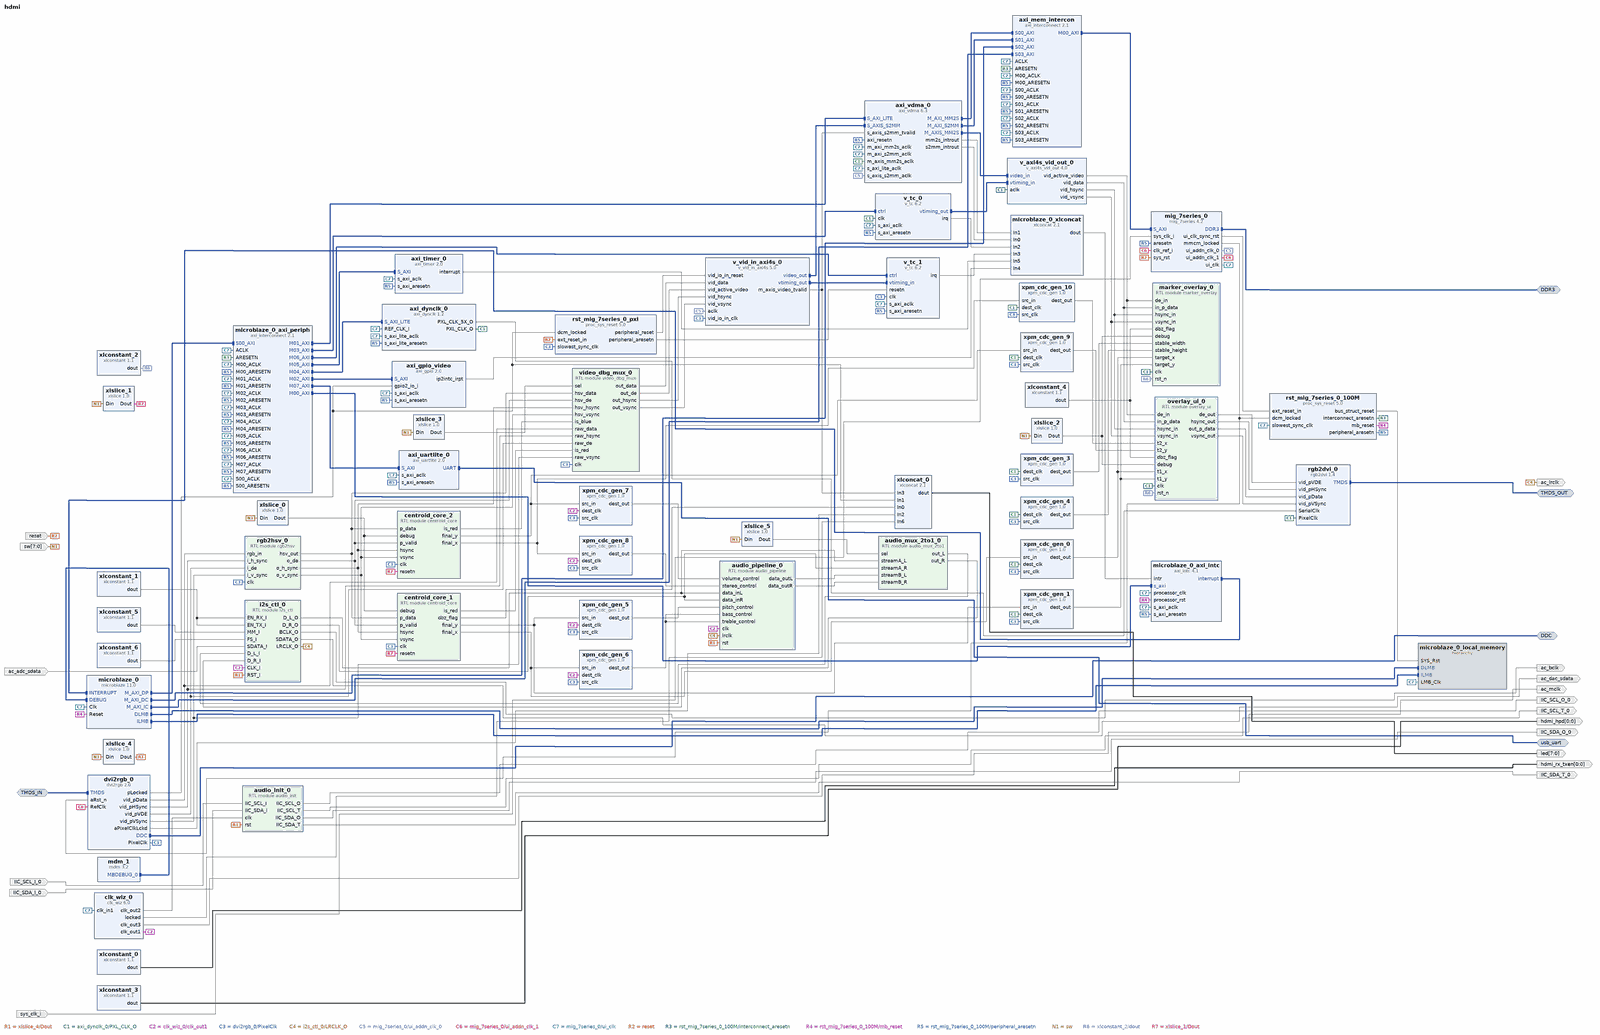
[diagram p0: block diagram of the top level, whole]
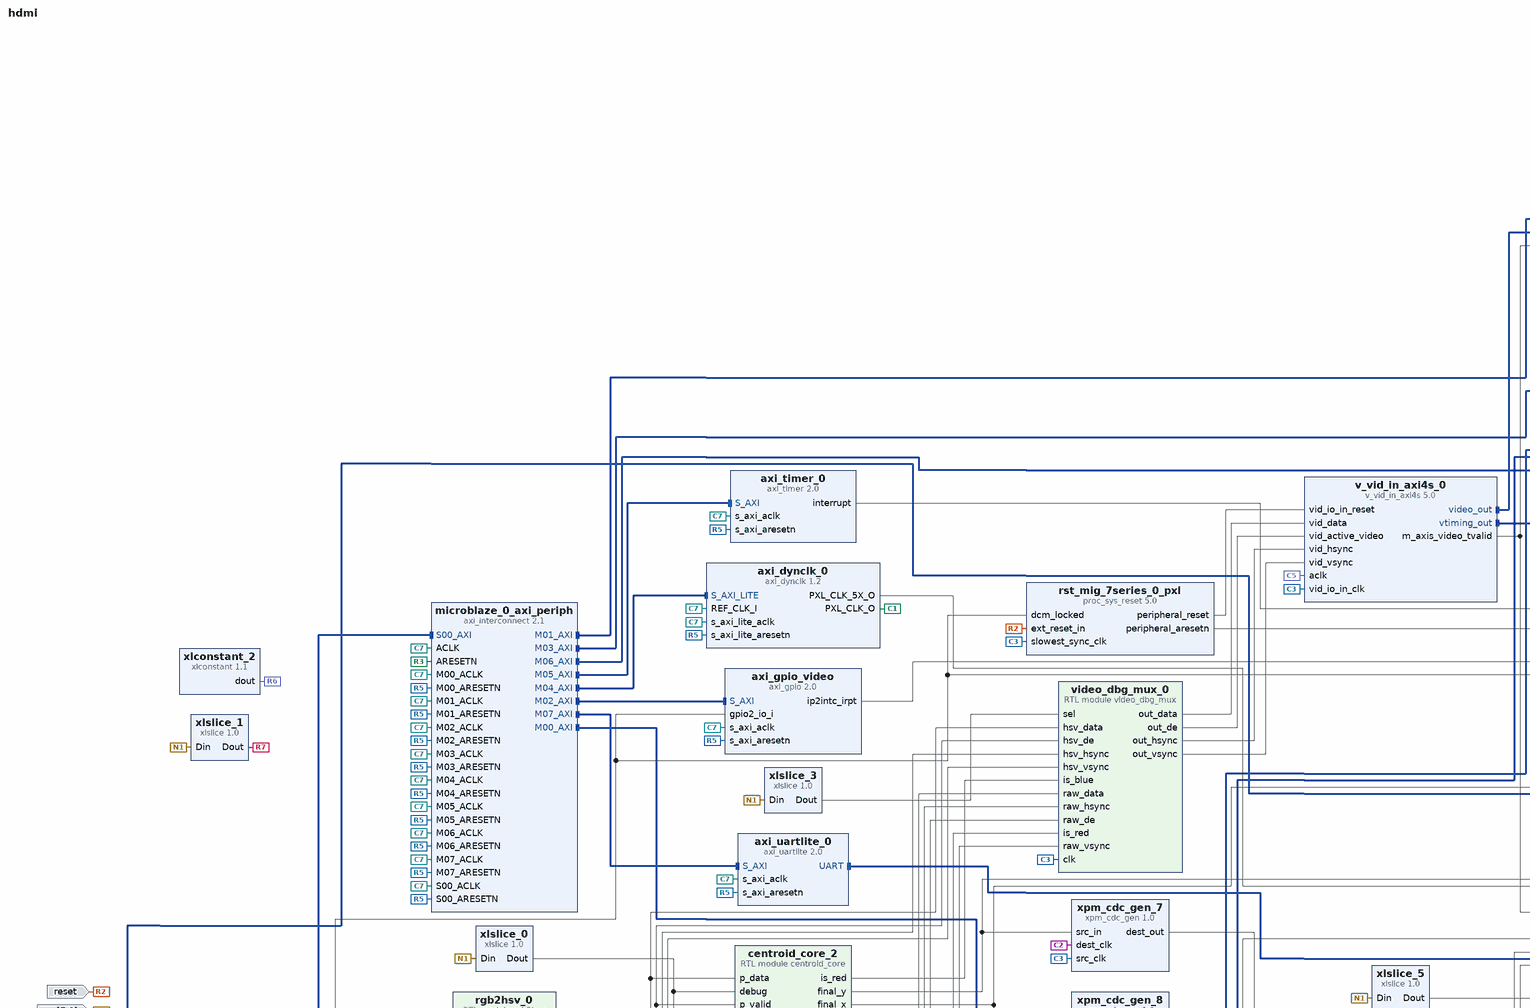
[diagram p1: block diagram of the top level, upper left part]
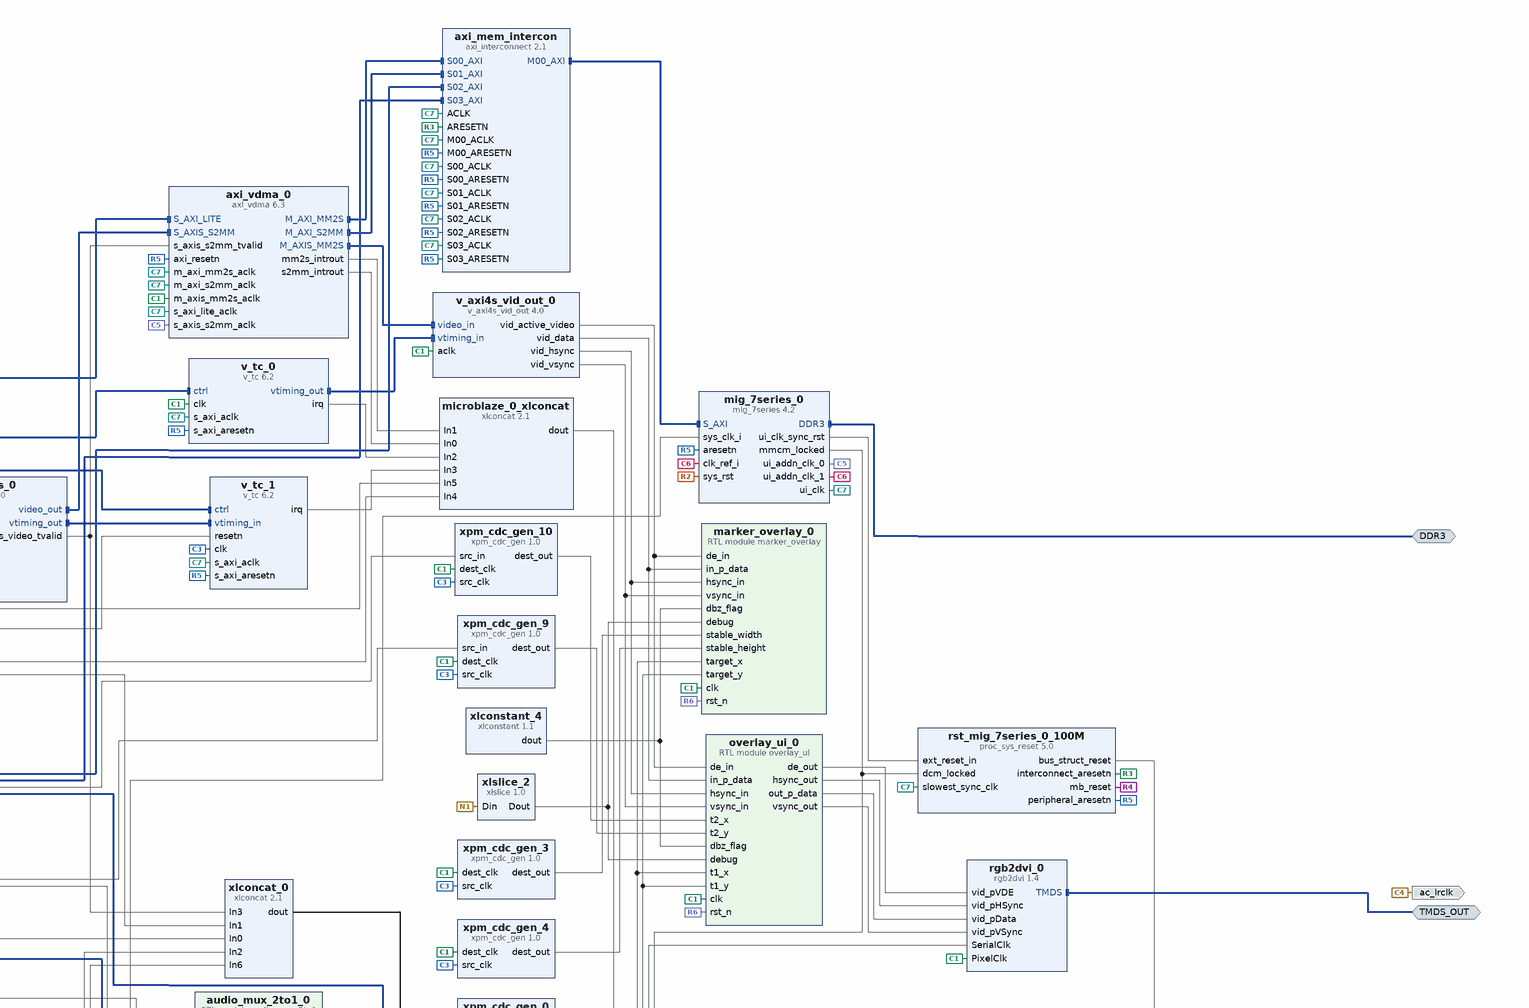
[diagram p2: block diagram of the top level, upper right part]
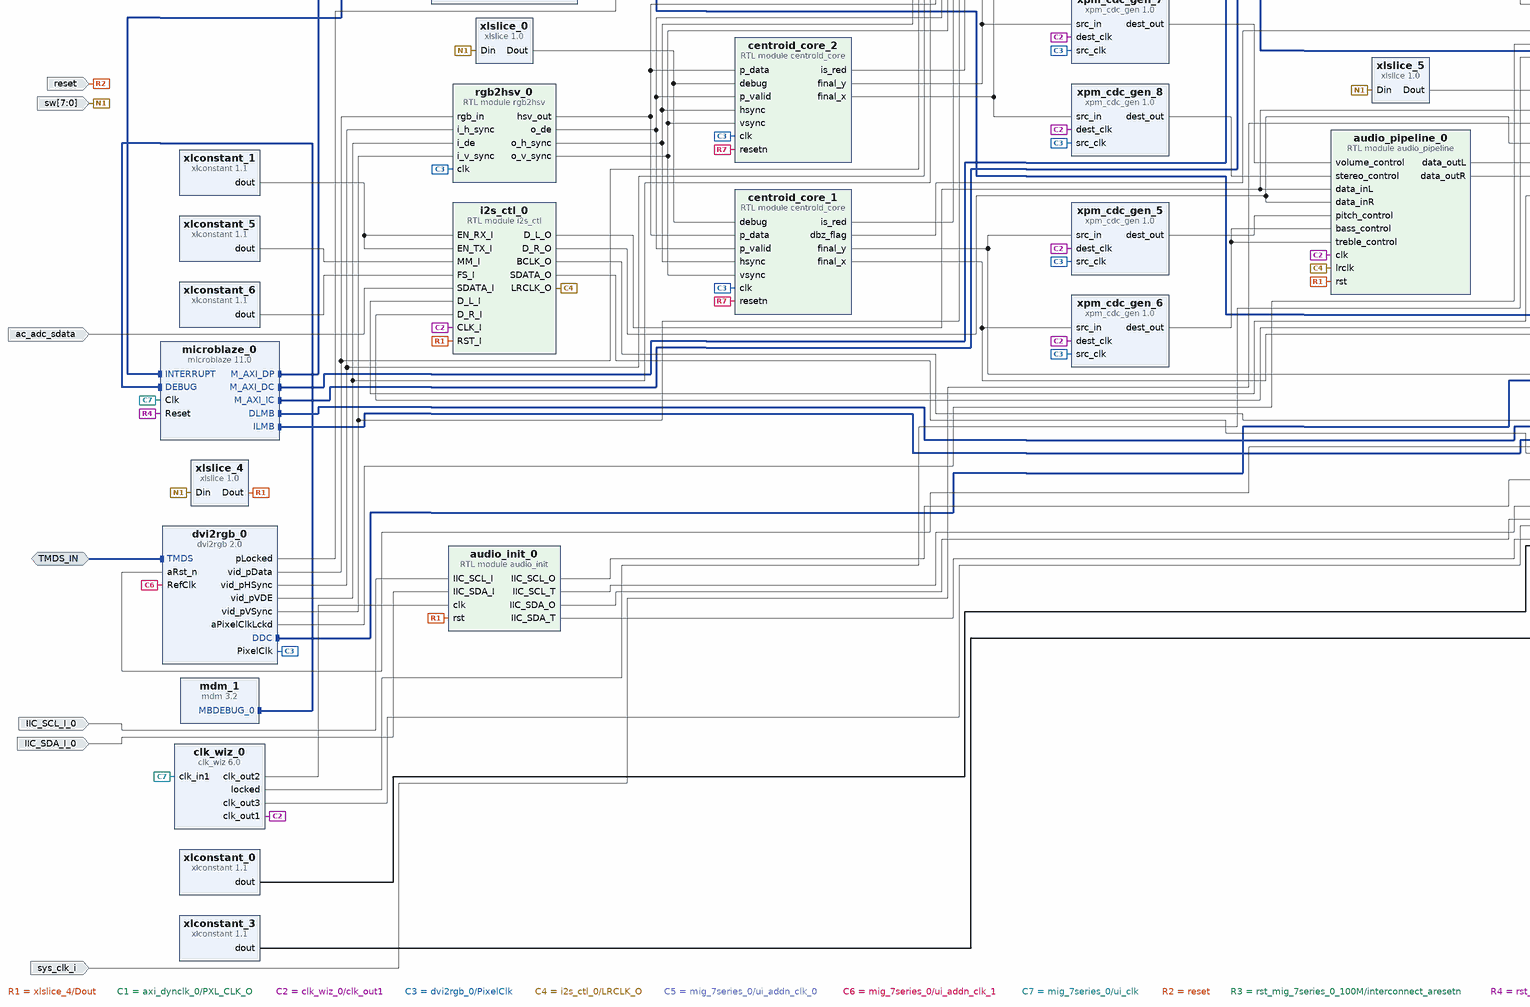
[diagram p3: block diagram of the top level, lower left part]
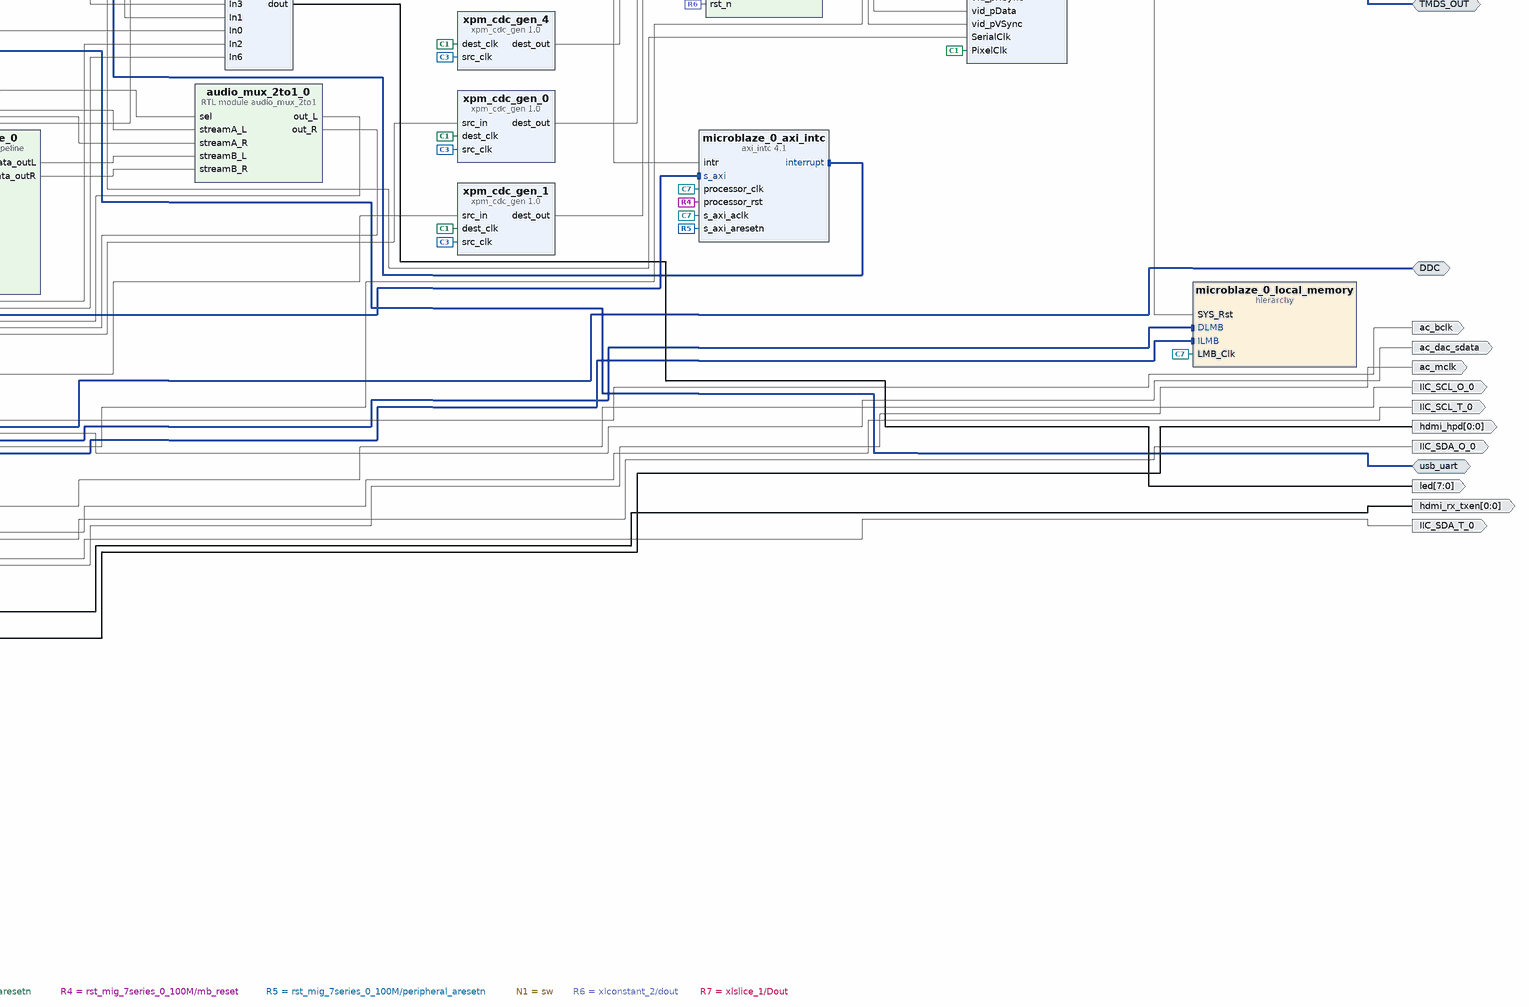
[diagram p4: block diagram of the top level, lower right part]
# Vivado block design hdmi, xc7a200tsbg484-1, Vivado 2024.1
create_bd_design hdmi

create_bd_intf_port -mode Master -vlnv xilinx.com:interface:iic_rtl:1.0 DDC
create_bd_intf_port -mode Master -vlnv xilinx.com:interface:ddrx_rtl:1.0 DDR3
create_bd_intf_port -mode Slave -vlnv digilentinc.com:interface:tmds_rtl:1.0 TMDS_IN
create_bd_intf_port -mode Master -vlnv digilentinc.com:interface:tmds_rtl:1.0 TMDS_OUT
create_bd_intf_port -mode Master -vlnv xilinx.com:interface:uart_rtl:1.0 usb_uart
create_bd_port -dir O -from 0 -to 0 hdmi_hpd
create_bd_port -dir O -from 0 -to 0 hdmi_rx_txen
create_bd_port -dir I -type rst reset
set_property -dict {CONFIG.POLARITY ACTIVE_LOW} [get_bd_ports reset]
create_bd_port -dir I -type clk sys_clk_i
set_property -dict {CONFIG.CLK_DOMAIN /clk_wiz_0_clk_out1 CONFIG.FREQ_HZ 200000000 CONFIG.PHASE 0.0} [get_bd_ports sys_clk_i]
create_bd_port -dir I -from 7 -to 0 -type data sw
create_bd_port -dir O -from 7 -to 0 -type data led
create_bd_port -dir O ac_bclk
create_bd_port -dir O ac_lrclk
create_bd_port -dir O ac_dac_sdata
create_bd_port -dir I ac_adc_sdata
create_bd_port -dir O -type clk ac_mclk
create_bd_port -dir I IIC_SCL_I_0
create_bd_port -dir O IIC_SCL_T_0
create_bd_port -dir I IIC_SDA_I_0
create_bd_port -dir O IIC_SDA_O_0
create_bd_port -dir O IIC_SDA_T_0
create_bd_port -dir O IIC_SCL_O_0

create_bd_cell -type ip -vlnv digilentinc.com:ip:axi_dynclk:1.2 axi_dynclk_0
set_property -dict {CONFIG.kAddBUFMR true} [get_bd_cells axi_dynclk_0]
create_bd_cell -type ip -vlnv digilentinc.com:ip:dvi2rgb:2.0 dvi2rgb_0
set_property -dict [list \
  CONFIG.kClkRange 1 \
  CONFIG.kEdidFileName dgl_1080p_cea.data \
  CONFIG.kRstActiveHigh false \
] [get_bd_cells dvi2rgb_0]
create_bd_cell -type ip -vlnv xilinx.com:ip:axi_intc:4.1 microblaze_0_axi_intc
set_property -dict {CONFIG.C_HAS_FAST 1} [get_bd_cells microblaze_0_axi_intc]
create_bd_cell -type hier microblaze_0_local_memory
create_bd_cell -type ip -vlnv xilinx.com:ip:xlconcat:2.1 microblaze_0_xlconcat
set_property -dict {CONFIG.NUM_PORTS 6} [get_bd_cells microblaze_0_xlconcat]
create_bd_cell -type ip -vlnv xilinx.com:ip:mig_7series:4.2 mig_7series_0
set_property -dict [list \
  CONFIG.BOARD_MIG_PARAM Custom \
  CONFIG.MIG_DONT_TOUCH_PARAM Custom \
  CONFIG.RESET_BOARD_INTERFACE reset \
  CONFIG.XML_INPUT_FILE mig_b.prj \
] [get_bd_cells mig_7series_0]
create_bd_cell -type ip -vlnv digilentinc.com:ip:rgb2dvi:1.4 rgb2dvi_0
set_property -dict {CONFIG.kGenerateSerialClk false CONFIG.kRstActiveHigh false} [get_bd_cells rgb2dvi_0]
create_bd_cell -type ip -vlnv xilinx.com:ip:proc_sys_reset:5.0 rst_mig_7series_0_100M
create_bd_cell -type ip -vlnv xilinx.com:ip:proc_sys_reset:5.0 rst_mig_7series_0_pxl
set_property -dict {CONFIG.RESET_BOARD_INTERFACE Custom CONFIG.USE_BOARD_FLOW true} [get_bd_cells rst_mig_7series_0_pxl]
create_bd_cell -type ip -vlnv xilinx.com:ip:axi_gpio:2.0 axi_gpio_video
set_property -dict [list \
  CONFIG.C_ALL_INPUTS_2 1 \
  CONFIG.C_ALL_OUTPUTS 1 \
  CONFIG.C_GPIO2_WIDTH 1 \
  CONFIG.C_GPIO_WIDTH 1 \
  CONFIG.C_INTERRUPT_PRESENT 1 \
  CONFIG.C_IS_DUAL 1 \
  CONFIG.GPIO_BOARD_INTERFACE Custom \
  CONFIG.USE_BOARD_FLOW true \
] [get_bd_cells axi_gpio_video]
create_bd_cell -type ip -vlnv xilinx.com:ip:axi_interconnect:2.1 axi_mem_intercon
set_property -dict [list \
  CONFIG.M00_HAS_DATA_FIFO 0 \
  CONFIG.M00_HAS_REGSLICE 4 \
  CONFIG.NUM_MI 1 \
  CONFIG.NUM_SI 4 \
  CONFIG.S00_HAS_DATA_FIFO 0 \
  CONFIG.S00_HAS_REGSLICE 4 \
  CONFIG.S01_HAS_DATA_FIFO 0 \
  CONFIG.S01_HAS_REGSLICE 4 \
  CONFIG.S02_HAS_DATA_FIFO 0 \
  CONFIG.S02_HAS_REGSLICE 4 \
  CONFIG.S03_HAS_DATA_FIFO 0 \
  CONFIG.S03_HAS_REGSLICE 4 \
  CONFIG.SYNCHRONIZATION_STAGES 2 \
] [get_bd_cells axi_mem_intercon]
create_bd_cell -type ip -vlnv xilinx.com:ip:axi_timer:2.0 axi_timer_0
create_bd_cell -type ip -vlnv xilinx.com:ip:axi_uartlite:2.0 axi_uartlite_0
set_property -dict [list \
  CONFIG.C_BAUDRATE 115200 \
  CONFIG.UARTLITE_BOARD_INTERFACE usb_uart \
  CONFIG.USE_BOARD_FLOW true \
] [get_bd_cells axi_uartlite_0]
create_bd_cell -type ip -vlnv xilinx.com:ip:axi_vdma:6.3 axi_vdma_0
set_property -dict [list \
  CONFIG.c_addr_width 32 \
  CONFIG.c_include_mm2s_dre 0 \
  CONFIG.c_include_s2mm 1 \
  CONFIG.c_include_s2mm_dre 0 \
  CONFIG.c_m_axi_mm2s_data_width 128 \
  CONFIG.c_m_axi_s2mm_data_width 128 \
  CONFIG.c_m_axis_mm2s_tdata_width 24 \
  CONFIG.c_mm2s_genlock_mode 0 \
  CONFIG.c_mm2s_linebuffer_depth 4096 \
  CONFIG.c_mm2s_max_burst_length 32 \
  CONFIG.c_s2mm_genlock_mode 0 \
  CONFIG.c_s2mm_linebuffer_depth 4096 \
  CONFIG.c_s2mm_max_burst_length 32 \
] [get_bd_cells axi_vdma_0]
create_bd_cell -type ip -vlnv xilinx.com:ip:mdm:3.2 mdm_1
create_bd_cell -type ip -vlnv xilinx.com:ip:microblaze:11.0 microblaze_0
set_property -dict [list \
  CONFIG.C_ADDR_TAG_BITS 14 \
  CONFIG.C_CACHE_BYTE_SIZE 32768 \
  CONFIG.C_DCACHE_ADDR_TAG 14 \
  CONFIG.C_DCACHE_BYTE_SIZE 32768 \
  CONFIG.C_DCACHE_DATA_WIDTH 1 \
  CONFIG.C_DCACHE_LINE_LEN 8 \
  CONFIG.C_DCACHE_USE_WRITEBACK 1 \
  CONFIG.C_DCACHE_VICTIMS 8 \
  CONFIG.C_DEBUG_COUNTER_WIDTH 32 \
  CONFIG.C_DEBUG_ENABLED 2 \
  CONFIG.C_D_AXI 1 \
  CONFIG.C_D_LMB 1 \
  CONFIG.C_ENABLE_CONVERSION 0 \
  CONFIG.C_ENABLE_DISCRETE_PORTS 0 \
  CONFIG.C_ICACHE_DATA_WIDTH 1 \
  CONFIG.C_ICACHE_LINE_LEN 8 \
  CONFIG.C_ICACHE_STREAMS 1 \
  CONFIG.C_ICACHE_VICTIMS 8 \
  CONFIG.C_I_LMB 1 \
  CONFIG.C_USE_BARREL 1 \
  CONFIG.C_USE_BRANCH_TARGET_CACHE 0 \
  CONFIG.C_USE_DCACHE 1 \
  CONFIG.C_USE_DIV 1 \
  CONFIG.C_USE_FPU 2 \
  CONFIG.C_USE_HW_MUL 2 \
  CONFIG.C_USE_ICACHE 1 \
  CONFIG.C_USE_MSR_INSTR 1 \
  CONFIG.C_USE_PCMP_INSTR 1 \
  CONFIG.C_USE_REORDER_INSTR 1 \
  CONFIG.G_TEMPLATE_LIST 2 \
  CONFIG.G_USE_EXCEPTIONS 1 \
] [get_bd_cells microblaze_0]
create_bd_cell -type ip -vlnv xilinx.com:ip:axi_interconnect:2.1 microblaze_0_axi_periph
set_property -dict {CONFIG.NUM_MI 8 CONFIG.SYNCHRONIZATION_STAGES 2} [get_bd_cells microblaze_0_axi_periph]
create_bd_cell -type ip -vlnv xilinx.com:ip:v_axi4s_vid_out:4.0 v_axi4s_vid_out_0
set_property -dict [list \
  CONFIG.C_ADDR_WIDTH 12 \
  CONFIG.C_S_AXIS_VIDEO_DATA_WIDTH 8 \
  CONFIG.C_S_AXIS_VIDEO_FORMAT 2 \
  CONFIG.C_VTG_MASTER_SLAVE 1 \
] [get_bd_cells v_axi4s_vid_out_0]
create_bd_cell -type ip -vlnv xilinx.com:ip:v_tc:6.2 v_tc_0
set_property -dict {CONFIG.enable_detection false} [get_bd_cells v_tc_0]
create_bd_cell -type ip -vlnv xilinx.com:ip:v_tc:6.2 v_tc_1
set_property -dict [list \
  CONFIG.HAS_INTC_IF true \
  CONFIG.enable_generation false \
  CONFIG.horizontal_blank_detection true \
  CONFIG.max_lines_per_frame 2048 \
  CONFIG.vertical_blank_detection true \
] [get_bd_cells v_tc_1]
create_bd_cell -type ip -vlnv xilinx.com:ip:v_vid_in_axi4s:5.0 v_vid_in_axi4s_0
set_property -dict {CONFIG.C_ADDR_WIDTH 12 CONFIG.C_HAS_ASYNC_CLK 1} [get_bd_cells v_vid_in_axi4s_0]
create_bd_cell -type ip -vlnv xilinx.com:ip:xlconstant:1.1 xlconstant_0
create_bd_cell -type ip -vlnv xilinx.com:ip:xlslice:1.0 xlslice_0
set_property -dict {CONFIG.DIN_FROM 6 CONFIG.DIN_TO 6 CONFIG.DIN_WIDTH 8 CONFIG.DOUT_WIDTH 1} [get_bd_cells xlslice_0]
create_bd_cell -type ip -vlnv xilinx.com:ip:xlconcat:2.1 xlconcat_0
set_property -dict {CONFIG.NUM_PORTS 8} [get_bd_cells xlconcat_0]
create_bd_cell -type module -reference marker_overlay marker_overlay_0
create_bd_cell -type ip -vlnv xilinx.com:ip:xpm_cdc_gen:1.0 xpm_cdc_gen_0
set_property -dict {CONFIG.DEST_SYNC_FF 4 CONFIG.WIDTH 11} [get_bd_cells xpm_cdc_gen_0]
create_bd_cell -type ip -vlnv xilinx.com:ip:xpm_cdc_gen:1.0 xpm_cdc_gen_1
set_property -dict {CONFIG.DEST_SYNC_FF 4 CONFIG.WIDTH 11} [get_bd_cells xpm_cdc_gen_1]
create_bd_cell -type ip -vlnv xilinx.com:ip:xlconstant:1.1 xlconstant_2
create_bd_cell -type ip -vlnv xilinx.com:ip:xlconstant:1.1 xlconstant_3
create_bd_cell -type ip -vlnv xilinx.com:ip:xlconstant:1.1 xlconstant_4
set_property -dict {CONFIG.CONST_VAL 0} [get_bd_cells xlconstant_4]
create_bd_cell -type ip -vlnv xilinx.com:ip:xlslice:1.0 xlslice_1
set_property -dict {CONFIG.DIN_FROM 7 CONFIG.DIN_TO 7 CONFIG.DIN_WIDTH 8 CONFIG.DOUT_WIDTH 1} [get_bd_cells xlslice_1]
create_bd_cell -type ip -vlnv xilinx.com:ip:xpm_cdc_gen:1.0 xpm_cdc_gen_3
set_property -dict {CONFIG.DEST_SYNC_FF 4 CONFIG.WIDTH 12} [get_bd_cells xpm_cdc_gen_3]
create_bd_cell -type ip -vlnv xilinx.com:ip:xpm_cdc_gen:1.0 xpm_cdc_gen_4
set_property -dict {CONFIG.DEST_SYNC_FF 4 CONFIG.WIDTH 12} [get_bd_cells xpm_cdc_gen_4]
create_bd_cell -type ip -vlnv xilinx.com:ip:xlslice:1.0 xlslice_2
set_property -dict {CONFIG.DIN_FROM 5 CONFIG.DIN_TO 5 CONFIG.DIN_WIDTH 8 CONFIG.DOUT_WIDTH 1} [get_bd_cells xlslice_2]
create_bd_cell -type module -reference centroid_core centroid_core_1
set_property -dict {CONFIG.COLOR_LB {"11111000"} CONFIG.COLOR_UB {"00001000"}} [get_bd_cells centroid_core_1]
create_bd_cell -type module -reference rgb2hsv rgb2hsv_0
create_bd_cell -type module -reference video_dbg_mux video_dbg_mux_0
create_bd_cell -type ip -vlnv xilinx.com:ip:xlslice:1.0 xlslice_3
set_property -dict {CONFIG.DIN_FROM 4 CONFIG.DIN_TO 3 CONFIG.DIN_WIDTH 8} [get_bd_cells xlslice_3]
create_bd_cell -type module -reference audio_init audio_init_0
create_bd_cell -type module -reference i2s_ctl i2s_ctl_0
create_bd_cell -type module -reference audio_pipeline audio_pipeline_0
create_bd_cell -type ip -vlnv xilinx.com:ip:xlconstant:1.1 xlconstant_1
create_bd_cell -type ip -vlnv xilinx.com:ip:xlconstant:1.1 xlconstant_5
set_property -dict {CONFIG.CONST_VAL 0} [get_bd_cells xlconstant_5]
create_bd_cell -type ip -vlnv xilinx.com:ip:xlconstant:1.1 xlconstant_6
set_property -dict {CONFIG.CONST_VAL 5 CONFIG.CONST_WIDTH 4} [get_bd_cells xlconstant_6]
create_bd_cell -type ip -vlnv xilinx.com:ip:clk_wiz:6.0 clk_wiz_0
set_property -dict [list \
  CONFIG.CLKOUT1_DRIVES BUFG \
  CONFIG.CLKOUT1_JITTER 137.681 \
  CONFIG.CLKOUT1_PHASE_ERROR 105.461 \
  CONFIG.CLKOUT2_DRIVES BUFG \
  CONFIG.CLKOUT2_JITTER 159.475 \
  CONFIG.CLKOUT2_PHASE_ERROR 105.461 \
  CONFIG.CLKOUT2_REQUESTED_OUT_FREQ 50 \
  CONFIG.CLKOUT2_USED true \
  CONFIG.CLKOUT3_DRIVES BUFG \
  CONFIG.CLKOUT3_JITTER 211.763 \
  CONFIG.CLKOUT3_PHASE_ERROR 105.461 \
  CONFIG.CLKOUT3_REQUESTED_OUT_FREQ 12 \
  CONFIG.CLKOUT3_USED true \
  CONFIG.CLKOUT4_DRIVES BUFG \
  CONFIG.CLKOUT5_DRIVES BUFG \
  CONFIG.CLKOUT6_DRIVES BUFG \
  CONFIG.CLKOUT7_DRIVES BUFG \
  CONFIG.CLK_IN1_BOARD_INTERFACE Custom \
  CONFIG.CLK_IN2_BOARD_INTERFACE Custom \
  CONFIG.FEEDBACK_SOURCE FDBK_AUTO \
  CONFIG.MMCM_BANDWIDTH OPTIMIZED \
  CONFIG.MMCM_CLKFBOUT_MULT_F 9.000 \
  CONFIG.MMCM_CLKOUT0_DIVIDE_F 9.000 \
  CONFIG.MMCM_CLKOUT1_DIVIDE 18 \
  CONFIG.MMCM_CLKOUT2_DIVIDE 75 \
  CONFIG.MMCM_COMPENSATION ZHOLD \
  CONFIG.NUM_OUT_CLKS 3 \
  CONFIG.PRIMITIVE MMCM \
  CONFIG.PRIM_SOURCE No_buffer \
  CONFIG.RESET_BOARD_INTERFACE Custom \
  CONFIG.SECONDARY_SOURCE Single_ended_clock_capable_pin \
  CONFIG.USE_BOARD_FLOW true \
  CONFIG.USE_FREQ_SYNTH true \
  CONFIG.USE_LOCKED true \
  CONFIG.USE_PHASE_ALIGNMENT true \
] [get_bd_cells clk_wiz_0]
create_bd_cell -type ip -vlnv xilinx.com:ip:xpm_cdc_gen:1.0 xpm_cdc_gen_5
set_property -dict {CONFIG.WIDTH 11} [get_bd_cells xpm_cdc_gen_5]
create_bd_cell -type ip -vlnv xilinx.com:ip:xlslice:1.0 xlslice_4
set_property -dict {CONFIG.DIN_FROM 2 CONFIG.DIN_TO 2 CONFIG.DIN_WIDTH 8} [get_bd_cells xlslice_4]
create_bd_cell -type module -reference audio_mux_2to1 audio_mux_2to1_0
create_bd_cell -type ip -vlnv xilinx.com:ip:xlslice:1.0 xlslice_5
set_property -dict {CONFIG.DIN_FROM 1 CONFIG.DIN_TO 1 CONFIG.DIN_WIDTH 8} [get_bd_cells xlslice_5]
create_bd_cell -type module -reference overlay_ui overlay_ui_0
create_bd_cell -type ip -vlnv xilinx.com:ip:xpm_cdc_gen:1.0 xpm_cdc_gen_6
set_property -dict {CONFIG.WIDTH 11} [get_bd_cells xpm_cdc_gen_6]
create_bd_cell -type module -reference centroid_core centroid_core_2
set_property -dict {CONFIG.COLOR_LB {"10100000"} CONFIG.COLOR_UB {"10110100"}} [get_bd_cells centroid_core_2]
create_bd_cell -type ip -vlnv xilinx.com:ip:xpm_cdc_gen:1.0 xpm_cdc_gen_7
set_property -dict {CONFIG.WIDTH 11} [get_bd_cells xpm_cdc_gen_7]
create_bd_cell -type ip -vlnv xilinx.com:ip:xpm_cdc_gen:1.0 xpm_cdc_gen_8
set_property -dict {CONFIG.WIDTH 11} [get_bd_cells xpm_cdc_gen_8]
create_bd_cell -type ip -vlnv xilinx.com:ip:xpm_cdc_gen:1.0 xpm_cdc_gen_9
set_property -dict {CONFIG.DEST_SYNC_FF 4 CONFIG.WIDTH 11} [get_bd_cells xpm_cdc_gen_9]
create_bd_cell -type ip -vlnv xilinx.com:ip:xpm_cdc_gen:1.0 xpm_cdc_gen_10
set_property -dict {CONFIG.DEST_SYNC_FF 4 CONFIG.WIDTH 11} [get_bd_cells xpm_cdc_gen_10]

# ---- hierarchy /microblaze_0_local_memory ----
current_bd_instance /microblaze_0_local_memory
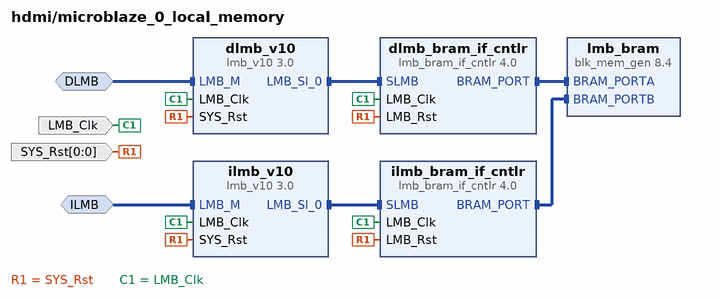
[diagram p5: block diagram inside /microblaze_0_local_memory]
create_bd_intf_pin -mode MirroredMaster -vlnv xilinx.com:interface:lmb_rtl:1.0 DLMB
create_bd_intf_pin -mode MirroredMaster -vlnv xilinx.com:interface:lmb_rtl:1.0 ILMB
create_bd_pin -dir I -type clk LMB_Clk
create_bd_pin -dir I -from 0 -to 0 -type rst SYS_Rst

create_bd_cell -type ip -vlnv xilinx.com:ip:lmb_v10:3.0 dlmb_v10
create_bd_cell -type ip -vlnv xilinx.com:ip:lmb_v10:3.0 ilmb_v10
create_bd_cell -type ip -vlnv xilinx.com:ip:lmb_bram_if_cntlr:4.0 dlmb_bram_if_cntlr
set_property -dict {CONFIG.C_ECC 0} [get_bd_cells dlmb_bram_if_cntlr]
create_bd_cell -type ip -vlnv xilinx.com:ip:lmb_bram_if_cntlr:4.0 ilmb_bram_if_cntlr
set_property -dict {CONFIG.C_ECC 0} [get_bd_cells ilmb_bram_if_cntlr]
create_bd_cell -type ip -vlnv xilinx.com:ip:blk_mem_gen:8.4 lmb_bram
set_property -dict [list \
  CONFIG.EN_SAFETY_CKT false \
  CONFIG.Enable_B Use_ENB_Pin \
  CONFIG.Memory_Type True_Dual_Port_RAM \
  CONFIG.Port_B_Clock 100 \
  CONFIG.Port_B_Enable_Rate 100 \
  CONFIG.Port_B_Write_Rate 50 \
  CONFIG.Use_RSTB_Pin true \
  CONFIG.use_bram_block BRAM_Controller \
] [get_bd_cells lmb_bram]

# ---- connections ----

current_bd_instance /microblaze_0_local_memory
connect_bd_intf_net -intf_net microblaze_0_dlmb [get_bd_intf_pins DLMB] [get_bd_intf_pins dlmb_v10/LMB_M]
connect_bd_intf_net -intf_net microblaze_0_dlmb_bus [get_bd_intf_pins dlmb_bram_if_cntlr/SLMB] [get_bd_intf_pins dlmb_v10/LMB_Sl_0]
connect_bd_intf_net -intf_net microblaze_0_dlmb_cntlr [get_bd_intf_pins dlmb_bram_if_cntlr/BRAM_PORT] [get_bd_intf_pins lmb_bram/BRAM_PORTA]
connect_bd_intf_net -intf_net microblaze_0_ilmb [get_bd_intf_pins ILMB] [get_bd_intf_pins ilmb_v10/LMB_M]
connect_bd_intf_net -intf_net microblaze_0_ilmb_bus [get_bd_intf_pins ilmb_bram_if_cntlr/SLMB] [get_bd_intf_pins ilmb_v10/LMB_Sl_0]
connect_bd_intf_net -intf_net microblaze_0_ilmb_cntlr [get_bd_intf_pins ilmb_bram_if_cntlr/BRAM_PORT] [get_bd_intf_pins lmb_bram/BRAM_PORTB]
connect_bd_net [get_bd_pins SYS_Rst] \
  [get_bd_pins dlmb_v10/SYS_Rst] [get_bd_pins ilmb_v10/SYS_Rst] [get_bd_pins dlmb_bram_if_cntlr/LMB_Rst] \
  [get_bd_pins ilmb_bram_if_cntlr/LMB_Rst]
connect_bd_net -net microblaze_0_Clk [get_bd_pins LMB_Clk] \
  [get_bd_pins dlmb_v10/LMB_Clk] [get_bd_pins ilmb_v10/LMB_Clk] [get_bd_pins dlmb_bram_if_cntlr/LMB_Clk] \
  [get_bd_pins ilmb_bram_if_cntlr/LMB_Clk]
set_property HDL_ATTRIBUTE.BMM_INFO_ADDRESS_SPACE {byte  0x00000000 32 > hdmi microblaze_0_local_memory/lmb_bram} [get_bd_cells dlmb_bram_if_cntlr]
set_property HDL_ATTRIBUTE.KEEP_HIERARCHY yes [get_bd_cells dlmb_bram_if_cntlr]

current_bd_instance /
connect_bd_intf_net [get_bd_intf_ports TMDS_IN] [get_bd_intf_pins dvi2rgb_0/TMDS]
connect_bd_intf_net [get_bd_intf_pins axi_mem_intercon/M00_AXI] [get_bd_intf_pins mig_7series_0/S_AXI]
connect_bd_intf_net [get_bd_intf_ports usb_uart] [get_bd_intf_pins axi_uartlite_0/UART]
connect_bd_intf_net [get_bd_intf_pins axi_vdma_0/M_AXIS_MM2S] [get_bd_intf_pins v_axi4s_vid_out_0/video_in]
connect_bd_intf_net [get_bd_intf_pins axi_mem_intercon/S00_AXI] [get_bd_intf_pins axi_vdma_0/M_AXI_MM2S]
connect_bd_intf_net [get_bd_intf_pins axi_mem_intercon/S01_AXI] [get_bd_intf_pins axi_vdma_0/M_AXI_S2MM]
connect_bd_intf_net [get_bd_intf_ports DDC] [get_bd_intf_pins dvi2rgb_0/DDC]
connect_bd_intf_net [get_bd_intf_pins axi_mem_intercon/S02_AXI] [get_bd_intf_pins microblaze_0/M_AXI_DC]
connect_bd_intf_net [get_bd_intf_pins axi_mem_intercon/S03_AXI] [get_bd_intf_pins microblaze_0/M_AXI_IC]
connect_bd_intf_net -intf_net microblaze_0_axi_dp [get_bd_intf_pins microblaze_0/M_AXI_DP] [get_bd_intf_pins microblaze_0_axi_periph/S00_AXI]
connect_bd_intf_net [get_bd_intf_pins axi_vdma_0/S_AXI_LITE] [get_bd_intf_pins microblaze_0_axi_periph/M01_AXI]
connect_bd_intf_net [get_bd_intf_pins axi_gpio_video/S_AXI] [get_bd_intf_pins microblaze_0_axi_periph/M02_AXI]
connect_bd_intf_net [get_bd_intf_pins microblaze_0_axi_periph/M03_AXI] [get_bd_intf_pins v_tc_0/ctrl]
connect_bd_intf_net [get_bd_intf_pins axi_dynclk_0/S_AXI_LITE] [get_bd_intf_pins microblaze_0_axi_periph/M04_AXI]
connect_bd_intf_net [get_bd_intf_pins axi_timer_0/S_AXI] [get_bd_intf_pins microblaze_0_axi_periph/M05_AXI]
connect_bd_intf_net [get_bd_intf_pins microblaze_0_axi_periph/M06_AXI] [get_bd_intf_pins v_tc_1/ctrl]
connect_bd_intf_net [get_bd_intf_pins axi_uartlite_0/S_AXI] [get_bd_intf_pins microblaze_0_axi_periph/M07_AXI]
connect_bd_intf_net [get_bd_intf_pins mdm_1/MBDEBUG_0] [get_bd_intf_pins microblaze_0/DEBUG]
connect_bd_intf_net [get_bd_intf_pins microblaze_0/DLMB] [get_bd_intf_pins microblaze_0_local_memory/DLMB]
connect_bd_intf_net [get_bd_intf_pins microblaze_0/ILMB] [get_bd_intf_pins microblaze_0_local_memory/ILMB]
connect_bd_intf_net -intf_net microblaze_0_intc_axi [get_bd_intf_pins microblaze_0_axi_intc/s_axi] [get_bd_intf_pins microblaze_0_axi_periph/M00_AXI]
connect_bd_intf_net [get_bd_intf_pins microblaze_0/INTERRUPT] [get_bd_intf_pins microblaze_0_axi_intc/interrupt]
connect_bd_intf_net [get_bd_intf_ports DDR3] [get_bd_intf_pins mig_7series_0/DDR3]
connect_bd_intf_net [get_bd_intf_ports TMDS_OUT] [get_bd_intf_pins rgb2dvi_0/TMDS]
connect_bd_intf_net [get_bd_intf_pins v_axi4s_vid_out_0/vtiming_in] [get_bd_intf_pins v_tc_0/vtiming_out]
connect_bd_intf_net [get_bd_intf_pins axi_vdma_0/S_AXIS_S2MM] [get_bd_intf_pins v_vid_in_axi4s_0/video_out]
connect_bd_intf_net [get_bd_intf_pins v_tc_1/vtiming_in] [get_bd_intf_pins v_vid_in_axi4s_0/vtiming_out]
connect_bd_net -net IIC_SCL_I_0_1 [get_bd_ports IIC_SCL_I_0] [get_bd_pins audio_init_0/IIC_SCL_I]
connect_bd_net -net IIC_SDA_I_0_1 [get_bd_ports IIC_SDA_I_0] [get_bd_pins audio_init_0/IIC_SDA_I]
connect_bd_net [get_bd_pins xlslice_4/Dout] [get_bd_pins i2s_ctl_0/RST_I] [get_bd_pins audio_init_0/rst] [get_bd_pins audio_pipeline_0/rst]
connect_bd_net -net SDATA_I_0_1 [get_bd_ports ac_adc_sdata] [get_bd_pins i2s_ctl_0/SDATA_I]
connect_bd_net -net SYS_Rst_1 [get_bd_pins rst_mig_7series_0_100M/bus_struct_reset] [get_bd_pins microblaze_0_local_memory/SYS_Rst]
connect_bd_net [get_bd_pins audio_init_0/IIC_SCL_O] [get_bd_ports IIC_SCL_O_0]
connect_bd_net [get_bd_pins audio_init_0/IIC_SCL_T] [get_bd_ports IIC_SCL_T_0]
connect_bd_net [get_bd_pins audio_init_0/IIC_SDA_O] [get_bd_ports IIC_SDA_O_0]
connect_bd_net [get_bd_pins audio_init_0/IIC_SDA_T] [get_bd_ports IIC_SDA_T_0]
connect_bd_net [get_bd_pins audio_mux_2to1_0/out_L] [get_bd_pins i2s_ctl_0/D_L_I]
connect_bd_net [get_bd_pins audio_mux_2to1_0/out_R] [get_bd_pins i2s_ctl_0/D_R_I]
connect_bd_net [get_bd_pins audio_pipeline_0/data_outL] [get_bd_pins audio_mux_2to1_0/streamB_L]
connect_bd_net [get_bd_pins audio_pipeline_0/data_outR] [get_bd_pins audio_mux_2to1_0/streamB_R]
connect_bd_net [get_bd_pins axi_dynclk_0/PXL_CLK_5X_O] [get_bd_pins rgb2dvi_0/SerialClk]
connect_bd_net [get_bd_pins axi_dynclk_0/PXL_CLK_O] \
  [get_bd_pins rgb2dvi_0/PixelClk] [get_bd_pins axi_vdma_0/m_axis_mm2s_aclk] [get_bd_pins v_axi4s_vid_out_0/aclk] \
  [get_bd_pins v_tc_0/clk] [get_bd_pins xpm_cdc_gen_0/dest_clk] [get_bd_pins xpm_cdc_gen_1/dest_clk] \
  [get_bd_pins xpm_cdc_gen_3/dest_clk] [get_bd_pins xpm_cdc_gen_4/dest_clk] [get_bd_pins marker_overlay_0/clk] \
  [get_bd_pins xpm_cdc_gen_9/dest_clk] [get_bd_pins xpm_cdc_gen_10/dest_clk] [get_bd_pins overlay_ui_0/clk]
connect_bd_net [get_bd_pins axi_gpio_video/ip2intc_irpt] [get_bd_pins microblaze_0_xlconcat/In4]
connect_bd_net [get_bd_pins axi_timer_0/interrupt] [get_bd_pins microblaze_0_xlconcat/In5]
connect_bd_net [get_bd_pins axi_vdma_0/mm2s_introut] [get_bd_pins microblaze_0_xlconcat/In1]
connect_bd_net [get_bd_pins axi_vdma_0/s2mm_introut] [get_bd_pins microblaze_0_xlconcat/In0]
connect_bd_net [get_bd_pins centroid_core_1/dbz_flag] [get_bd_pins xlconcat_0/In0]
connect_bd_net [get_bd_pins centroid_core_1/final_x] [get_bd_pins xpm_cdc_gen_0/src_in] [get_bd_pins xpm_cdc_gen_6/src_in]
connect_bd_net [get_bd_pins centroid_core_1/final_y] [get_bd_pins xpm_cdc_gen_1/src_in] [get_bd_pins xpm_cdc_gen_5/src_in]
connect_bd_net [get_bd_pins centroid_core_1/is_red] [get_bd_pins video_dbg_mux_0/is_red]
connect_bd_net [get_bd_pins centroid_core_2/final_x] [get_bd_pins xpm_cdc_gen_8/src_in] [get_bd_pins xpm_cdc_gen_10/src_in]
connect_bd_net [get_bd_pins centroid_core_2/final_y] [get_bd_pins xpm_cdc_gen_7/src_in] [get_bd_pins xpm_cdc_gen_9/src_in]
connect_bd_net [get_bd_pins centroid_core_2/is_red] [get_bd_pins video_dbg_mux_0/is_blue]
connect_bd_net [get_bd_pins clk_wiz_0/clk_out1] \
  [get_bd_pins i2s_ctl_0/CLK_I] [get_bd_pins xpm_cdc_gen_5/dest_clk] [get_bd_pins xpm_cdc_gen_6/dest_clk] \
  [get_bd_pins xpm_cdc_gen_7/dest_clk] [get_bd_pins xpm_cdc_gen_8/dest_clk] [get_bd_pins audio_pipeline_0/clk]
connect_bd_net [get_bd_pins clk_wiz_0/clk_out2] [get_bd_pins audio_init_0/clk]
connect_bd_net [get_bd_pins clk_wiz_0/clk_out3] [get_bd_ports ac_mclk]
connect_bd_net [get_bd_pins clk_wiz_0/locked] [get_bd_pins xlconcat_0/In6]
connect_bd_net [get_bd_pins dvi2rgb_0/PixelClk] \
  [get_bd_pins rst_mig_7series_0_pxl/slowest_sync_clk] [get_bd_pins v_tc_1/clk] [get_bd_pins v_vid_in_axi4s_0/vid_io_in_clk] \
  [get_bd_pins xpm_cdc_gen_0/src_clk] [get_bd_pins xpm_cdc_gen_1/src_clk] [get_bd_pins xpm_cdc_gen_3/src_clk] \
  [get_bd_pins xpm_cdc_gen_4/src_clk] [get_bd_pins xpm_cdc_gen_5/src_clk] [get_bd_pins xpm_cdc_gen_6/src_clk] \
  [get_bd_pins xpm_cdc_gen_7/src_clk] [get_bd_pins xpm_cdc_gen_8/src_clk] [get_bd_pins xpm_cdc_gen_9/src_clk] \
  [get_bd_pins xpm_cdc_gen_10/src_clk] [get_bd_pins rgb2hsv_0/clk] [get_bd_pins video_dbg_mux_0/clk] \
  [get_bd_pins centroid_core_1/clk] [get_bd_pins centroid_core_2/clk]
connect_bd_net -net dvi2rgb_0_aPixelClkLckd [get_bd_pins dvi2rgb_0/pLocked] \
  [get_bd_pins rst_mig_7series_0_pxl/dcm_locked] [get_bd_pins axi_gpio_video/gpio2_io_i] [get_bd_pins xlconcat_0/In1]
connect_bd_net [get_bd_pins dvi2rgb_0/aPixelClkLckd] [get_bd_pins xlconcat_0/In2]
connect_bd_net [get_bd_pins dvi2rgb_0/vid_pData] [get_bd_pins rgb2hsv_0/rgb_in] [get_bd_pins video_dbg_mux_0/raw_data]
connect_bd_net [get_bd_pins dvi2rgb_0/vid_pHSync] [get_bd_pins rgb2hsv_0/i_h_sync] [get_bd_pins video_dbg_mux_0/raw_hsync]
connect_bd_net [get_bd_pins dvi2rgb_0/vid_pVDE] [get_bd_pins rgb2hsv_0/i_de] [get_bd_pins video_dbg_mux_0/raw_de]
connect_bd_net [get_bd_pins dvi2rgb_0/vid_pVSync] [get_bd_pins rgb2hsv_0/i_v_sync] [get_bd_pins video_dbg_mux_0/raw_vsync]
connect_bd_net [get_bd_pins i2s_ctl_0/BCLK_O] [get_bd_ports ac_bclk]
connect_bd_net [get_bd_pins i2s_ctl_0/D_L_O] [get_bd_pins audio_mux_2to1_0/streamA_L] [get_bd_pins audio_pipeline_0/data_inL]
connect_bd_net [get_bd_pins i2s_ctl_0/D_R_O] [get_bd_pins audio_mux_2to1_0/streamA_R] [get_bd_pins audio_pipeline_0/data_inR]
connect_bd_net [get_bd_pins i2s_ctl_0/LRCLK_O] [get_bd_ports ac_lrclk] [get_bd_pins audio_pipeline_0/lrclk]
connect_bd_net [get_bd_pins i2s_ctl_0/SDATA_O] [get_bd_ports ac_dac_sdata]
connect_bd_net -net microblaze_0_intr [get_bd_pins microblaze_0_xlconcat/dout] [get_bd_pins microblaze_0_axi_intc/intr]
connect_bd_net [get_bd_pins mig_7series_0/mmcm_locked] [get_bd_pins dvi2rgb_0/aRst_n] [get_bd_pins rst_mig_7series_0_100M/dcm_locked]
connect_bd_net [get_bd_pins mig_7series_0/ui_addn_clk_0] [get_bd_pins axi_vdma_0/s_axis_s2mm_aclk] [get_bd_pins v_vid_in_axi4s_0/aclk]
connect_bd_net [get_bd_pins mig_7series_0/ui_addn_clk_1] [get_bd_pins dvi2rgb_0/RefClk] [get_bd_pins mig_7series_0/clk_ref_i]
connect_bd_net [get_bd_pins mig_7series_0/ui_clk] \
  [get_bd_pins axi_dynclk_0/REF_CLK_I] [get_bd_pins axi_dynclk_0/s_axi_lite_aclk] \
  [get_bd_pins microblaze_0_axi_intc/processor_clk] [get_bd_pins microblaze_0_axi_intc/s_axi_aclk] \
  [get_bd_pins microblaze_0_local_memory/LMB_Clk] [get_bd_pins rst_mig_7series_0_100M/slowest_sync_clk] \
  [get_bd_pins axi_gpio_video/s_axi_aclk] [get_bd_pins axi_mem_intercon/ACLK] [get_bd_pins axi_mem_intercon/S00_ACLK] \
  [get_bd_pins axi_mem_intercon/M00_ACLK] [get_bd_pins axi_mem_intercon/S01_ACLK] [get_bd_pins axi_mem_intercon/S02_ACLK] \
  [get_bd_pins axi_mem_intercon/S03_ACLK] [get_bd_pins axi_timer_0/s_axi_aclk] [get_bd_pins axi_uartlite_0/s_axi_aclk] \
  [get_bd_pins axi_vdma_0/s_axi_lite_aclk] [get_bd_pins axi_vdma_0/m_axi_mm2s_aclk] [get_bd_pins axi_vdma_0/m_axi_s2mm_aclk] \
  [get_bd_pins microblaze_0/Clk] [get_bd_pins microblaze_0_axi_periph/ACLK] [get_bd_pins microblaze_0_axi_periph/S00_ACLK] \
  [get_bd_pins microblaze_0_axi_periph/M00_ACLK] [get_bd_pins microblaze_0_axi_periph/M01_ACLK] \
  [get_bd_pins microblaze_0_axi_periph/M02_ACLK] [get_bd_pins microblaze_0_axi_periph/M03_ACLK] \
  [get_bd_pins microblaze_0_axi_periph/M04_ACLK] [get_bd_pins microblaze_0_axi_periph/M05_ACLK] \
  [get_bd_pins microblaze_0_axi_periph/M06_ACLK] [get_bd_pins microblaze_0_axi_periph/M07_ACLK] \
  [get_bd_pins v_tc_0/s_axi_aclk] [get_bd_pins v_tc_1/s_axi_aclk] [get_bd_pins clk_wiz_0/clk_in1]
connect_bd_net [get_bd_pins mig_7series_0/ui_clk_sync_rst] [get_bd_pins rst_mig_7series_0_100M/ext_reset_in]
connect_bd_net [get_bd_pins overlay_ui_0/de_out] [get_bd_pins rgb2dvi_0/vid_pVDE]
connect_bd_net [get_bd_pins overlay_ui_0/hsync_out] [get_bd_pins rgb2dvi_0/vid_pHSync]
connect_bd_net [get_bd_pins overlay_ui_0/out_p_data] [get_bd_pins rgb2dvi_0/vid_pData]
connect_bd_net [get_bd_pins overlay_ui_0/vsync_out] [get_bd_pins rgb2dvi_0/vid_pVSync]
connect_bd_net [get_bd_ports reset] [get_bd_pins mig_7series_0/sys_rst] [get_bd_pins rst_mig_7series_0_pxl/ext_reset_in]
connect_bd_net [get_bd_pins rgb2hsv_0/hsv_out] \
  [get_bd_pins video_dbg_mux_0/hsv_data] [get_bd_pins centroid_core_1/p_data] [get_bd_pins centroid_core_2/p_data]
connect_bd_net [get_bd_pins rgb2hsv_0/o_de] \
  [get_bd_pins video_dbg_mux_0/hsv_de] [get_bd_pins centroid_core_1/p_valid] [get_bd_pins centroid_core_2/p_valid]
connect_bd_net [get_bd_pins rgb2hsv_0/o_h_sync] \
  [get_bd_pins video_dbg_mux_0/hsv_hsync] [get_bd_pins centroid_core_1/hsync] [get_bd_pins centroid_core_2/hsync]
connect_bd_net [get_bd_pins rgb2hsv_0/o_v_sync] \
  [get_bd_pins video_dbg_mux_0/hsv_vsync] [get_bd_pins centroid_core_1/vsync] [get_bd_pins centroid_core_2/vsync]
connect_bd_net [get_bd_pins rst_mig_7series_0_100M/interconnect_aresetn] \
  [get_bd_pins axi_mem_intercon/ARESETN] [get_bd_pins microblaze_0_axi_periph/ARESETN]
connect_bd_net [get_bd_pins rst_mig_7series_0_100M/mb_reset] [get_bd_pins microblaze_0_axi_intc/processor_rst] [get_bd_pins microblaze_0/Reset]
connect_bd_net [get_bd_pins rst_mig_7series_0_100M/peripheral_aresetn] \
  [get_bd_pins axi_dynclk_0/s_axi_lite_aresetn] [get_bd_pins microblaze_0_axi_intc/s_axi_aresetn] \
  [get_bd_pins mig_7series_0/aresetn] [get_bd_pins axi_gpio_video/s_axi_aresetn] [get_bd_pins axi_mem_intercon/S00_ARESETN] \
  [get_bd_pins axi_mem_intercon/M00_ARESETN] [get_bd_pins axi_mem_intercon/S01_ARESETN] \
  [get_bd_pins axi_mem_intercon/S02_ARESETN] [get_bd_pins axi_mem_intercon/S03_ARESETN] \
  [get_bd_pins axi_timer_0/s_axi_aresetn] [get_bd_pins axi_uartlite_0/s_axi_aresetn] [get_bd_pins axi_vdma_0/axi_resetn] \
  [get_bd_pins microblaze_0_axi_periph/S00_ARESETN] [get_bd_pins microblaze_0_axi_periph/M00_ARESETN] \
  [get_bd_pins microblaze_0_axi_periph/M01_ARESETN] [get_bd_pins microblaze_0_axi_periph/M02_ARESETN] \
  [get_bd_pins microblaze_0_axi_periph/M03_ARESETN] [get_bd_pins microblaze_0_axi_periph/M04_ARESETN] \
  [get_bd_pins microblaze_0_axi_periph/M05_ARESETN] [get_bd_pins microblaze_0_axi_periph/M06_ARESETN] \
  [get_bd_pins microblaze_0_axi_periph/M07_ARESETN] [get_bd_pins v_tc_0/s_axi_aresetn] [get_bd_pins v_tc_1/s_axi_aresetn]
connect_bd_net [get_bd_pins rst_mig_7series_0_pxl/peripheral_aresetn] [get_bd_pins v_tc_1/resetn]
connect_bd_net [get_bd_pins rst_mig_7series_0_pxl/peripheral_reset] [get_bd_pins v_vid_in_axi4s_0/vid_io_in_reset]
connect_bd_net [get_bd_ports sw] \
  [get_bd_pins xlslice_0/Din] [get_bd_pins xlslice_1/Din] [get_bd_pins xlslice_2/Din] [get_bd_pins xlslice_3/Din] \
  [get_bd_pins xlslice_4/Din] [get_bd_pins xlslice_5/Din]
connect_bd_net [get_bd_ports sys_clk_i] [get_bd_pins mig_7series_0/sys_clk_i]
connect_bd_net [get_bd_pins v_axi4s_vid_out_0/vid_active_video] [get_bd_pins marker_overlay_0/de_in] [get_bd_pins overlay_ui_0/de_in]
connect_bd_net [get_bd_pins v_axi4s_vid_out_0/vid_data] [get_bd_pins marker_overlay_0/in_p_data] [get_bd_pins overlay_ui_0/in_p_data]
connect_bd_net [get_bd_pins v_axi4s_vid_out_0/vid_hsync] [get_bd_pins marker_overlay_0/hsync_in] [get_bd_pins overlay_ui_0/hsync_in]
connect_bd_net [get_bd_pins v_axi4s_vid_out_0/vid_vsync] [get_bd_pins marker_overlay_0/vsync_in] [get_bd_pins overlay_ui_0/vsync_in]
connect_bd_net [get_bd_pins v_tc_0/irq] [get_bd_pins microblaze_0_xlconcat/In2]
connect_bd_net [get_bd_pins v_tc_1/irq] [get_bd_pins microblaze_0_xlconcat/In3]
connect_bd_net [get_bd_pins v_vid_in_axi4s_0/m_axis_video_tvalid] [get_bd_pins xlconcat_0/In3] [get_bd_pins axi_vdma_0/s_axis_s2mm_tvalid]
connect_bd_net [get_bd_pins video_dbg_mux_0/out_data] [get_bd_pins v_vid_in_axi4s_0/vid_data]
connect_bd_net [get_bd_pins video_dbg_mux_0/out_de] [get_bd_pins v_vid_in_axi4s_0/vid_active_video]
connect_bd_net [get_bd_pins video_dbg_mux_0/out_hsync] [get_bd_pins v_vid_in_axi4s_0/vid_hsync]
connect_bd_net [get_bd_pins video_dbg_mux_0/out_vsync] [get_bd_pins v_vid_in_axi4s_0/vid_vsync]
connect_bd_net [get_bd_pins xlconcat_0/dout] [get_bd_ports led]
connect_bd_net [get_bd_pins xlconstant_0/dout] [get_bd_ports hdmi_rx_txen]
connect_bd_net [get_bd_pins xlconstant_1/dout] [get_bd_pins i2s_ctl_0/EN_TX_I] [get_bd_pins i2s_ctl_0/EN_RX_I]
connect_bd_net [get_bd_pins xlconstant_2/dout] [get_bd_pins marker_overlay_0/rst_n] [get_bd_pins overlay_ui_0/rst_n]
connect_bd_net [get_bd_pins xlconstant_3/dout] [get_bd_ports hdmi_hpd]
connect_bd_net [get_bd_pins xlconstant_4/dout] [get_bd_pins marker_overlay_0/dbz_flag] [get_bd_pins overlay_ui_0/dbz_flag]
connect_bd_net [get_bd_pins xlconstant_5/dout] [get_bd_pins i2s_ctl_0/MM_I]
connect_bd_net [get_bd_pins xlconstant_6/dout] [get_bd_pins i2s_ctl_0/FS_I]
connect_bd_net [get_bd_pins xlslice_0/Dout] [get_bd_pins centroid_core_1/debug] [get_bd_pins centroid_core_2/debug]
connect_bd_net [get_bd_pins xlslice_1/Dout] [get_bd_pins centroid_core_1/resetn] [get_bd_pins centroid_core_2/resetn]
connect_bd_net [get_bd_pins xlslice_2/Dout] [get_bd_pins marker_overlay_0/debug] [get_bd_pins overlay_ui_0/debug]
connect_bd_net [get_bd_pins xlslice_3/Dout] [get_bd_pins video_dbg_mux_0/sel]
connect_bd_net [get_bd_pins xlslice_5/Dout] [get_bd_pins audio_mux_2to1_0/sel]
connect_bd_net [get_bd_pins xpm_cdc_gen_0/dest_out] [get_bd_pins marker_overlay_0/target_x] [get_bd_pins overlay_ui_0/t1_x]
connect_bd_net [get_bd_pins xpm_cdc_gen_10/dest_out] [get_bd_pins overlay_ui_0/t2_x]
connect_bd_net [get_bd_pins xpm_cdc_gen_1/dest_out] [get_bd_pins marker_overlay_0/target_y] [get_bd_pins overlay_ui_0/t1_y]
connect_bd_net [get_bd_pins xpm_cdc_gen_3/dest_out] [get_bd_pins marker_overlay_0/stable_width]
connect_bd_net [get_bd_pins xpm_cdc_gen_4/dest_out] [get_bd_pins marker_overlay_0/stable_height]
connect_bd_net [get_bd_pins xpm_cdc_gen_5/dest_out] [get_bd_pins audio_pipeline_0/pitch_control]
connect_bd_net [get_bd_pins xpm_cdc_gen_6/dest_out] [get_bd_pins audio_pipeline_0/bass_control] [get_bd_pins audio_pipeline_0/treble_control]
connect_bd_net [get_bd_pins xpm_cdc_gen_7/dest_out] [get_bd_pins audio_pipeline_0/volume_control]
connect_bd_net [get_bd_pins xpm_cdc_gen_8/dest_out] [get_bd_pins audio_pipeline_0/stereo_control]
connect_bd_net [get_bd_pins xpm_cdc_gen_9/dest_out] [get_bd_pins overlay_ui_0/t2_y]
set_property HDL_ATTRIBUTE.BMM_INFO_PROCESSOR {microblaze-le > hdmi microblaze_0_local_memory/dlmb_bram_if_cntlr} [get_bd_cells microblaze_0]
set_property HDL_ATTRIBUTE.KEEP_HIERARCHY yes [get_bd_cells microblaze_0]

# ---- address map ----
assign_bd_address -offset 0x80000000 -range 512M -target_address_space [get_bd_addr_spaces axi_vdma_0/Data_MM2S] [get_bd_addr_segs mig_7series_0/memmap/memaddr]
assign_bd_address -offset 0x80000000 -range 512M -target_address_space [get_bd_addr_spaces axi_vdma_0/Data_S2MM] [get_bd_addr_segs mig_7series_0/memmap/memaddr]
assign_bd_address -offset 0x00000000 -range 8K -target_address_space [get_bd_addr_spaces microblaze_0/Data] [get_bd_addr_segs microblaze_0_local_memory/dlmb_bram_if_cntlr/SLMB/Mem]
assign_bd_address -offset 0x40000000 -range 64K -target_address_space [get_bd_addr_spaces microblaze_0/Data] [get_bd_addr_segs axi_gpio_video/S_AXI/Reg]
assign_bd_address -offset 0x40600000 -range 64K -target_address_space [get_bd_addr_spaces microblaze_0/Data] [get_bd_addr_segs axi_uartlite_0/S_AXI/Reg]
assign_bd_address -offset 0x41200000 -range 64K -target_address_space [get_bd_addr_spaces microblaze_0/Data] [get_bd_addr_segs microblaze_0_axi_intc/S_AXI/Reg]
assign_bd_address -offset 0x41C00000 -range 64K -target_address_space [get_bd_addr_spaces microblaze_0/Data] [get_bd_addr_segs axi_timer_0/S_AXI/Reg]
assign_bd_address -offset 0x44A00000 -range 64K -target_address_space [get_bd_addr_spaces microblaze_0/Data] [get_bd_addr_segs axi_dynclk_0/S_AXI_LITE/S_AXI_LITE_reg]
assign_bd_address -offset 0x44A10000 -range 64K -target_address_space [get_bd_addr_spaces microblaze_0/Data] [get_bd_addr_segs axi_vdma_0/S_AXI_LITE/Reg]
assign_bd_address -offset 0x44A20000 -range 64K -target_address_space [get_bd_addr_spaces microblaze_0/Data] [get_bd_addr_segs v_tc_0/ctrl/Reg]
assign_bd_address -offset 0x44A30000 -range 64K -target_address_space [get_bd_addr_spaces microblaze_0/Data] [get_bd_addr_segs v_tc_1/ctrl/Reg]
assign_bd_address -offset 0x80000000 -range 512M -target_address_space [get_bd_addr_spaces microblaze_0/Data] [get_bd_addr_segs mig_7series_0/memmap/memaddr]
assign_bd_address -offset 0x00000000 -range 8K -target_address_space [get_bd_addr_spaces microblaze_0/Instruction] [get_bd_addr_segs microblaze_0_local_memory/ilmb_bram_if_cntlr/SLMB/Mem]
assign_bd_address -offset 0x80000000 -range 512M -target_address_space [get_bd_addr_spaces microblaze_0/Instruction] [get_bd_addr_segs mig_7series_0/memmap/memaddr]

validate_bd_design
save_bd_design
